# EAGLE design Physical_Computing_Bridge_V6 (EAGLE 8.5.1)
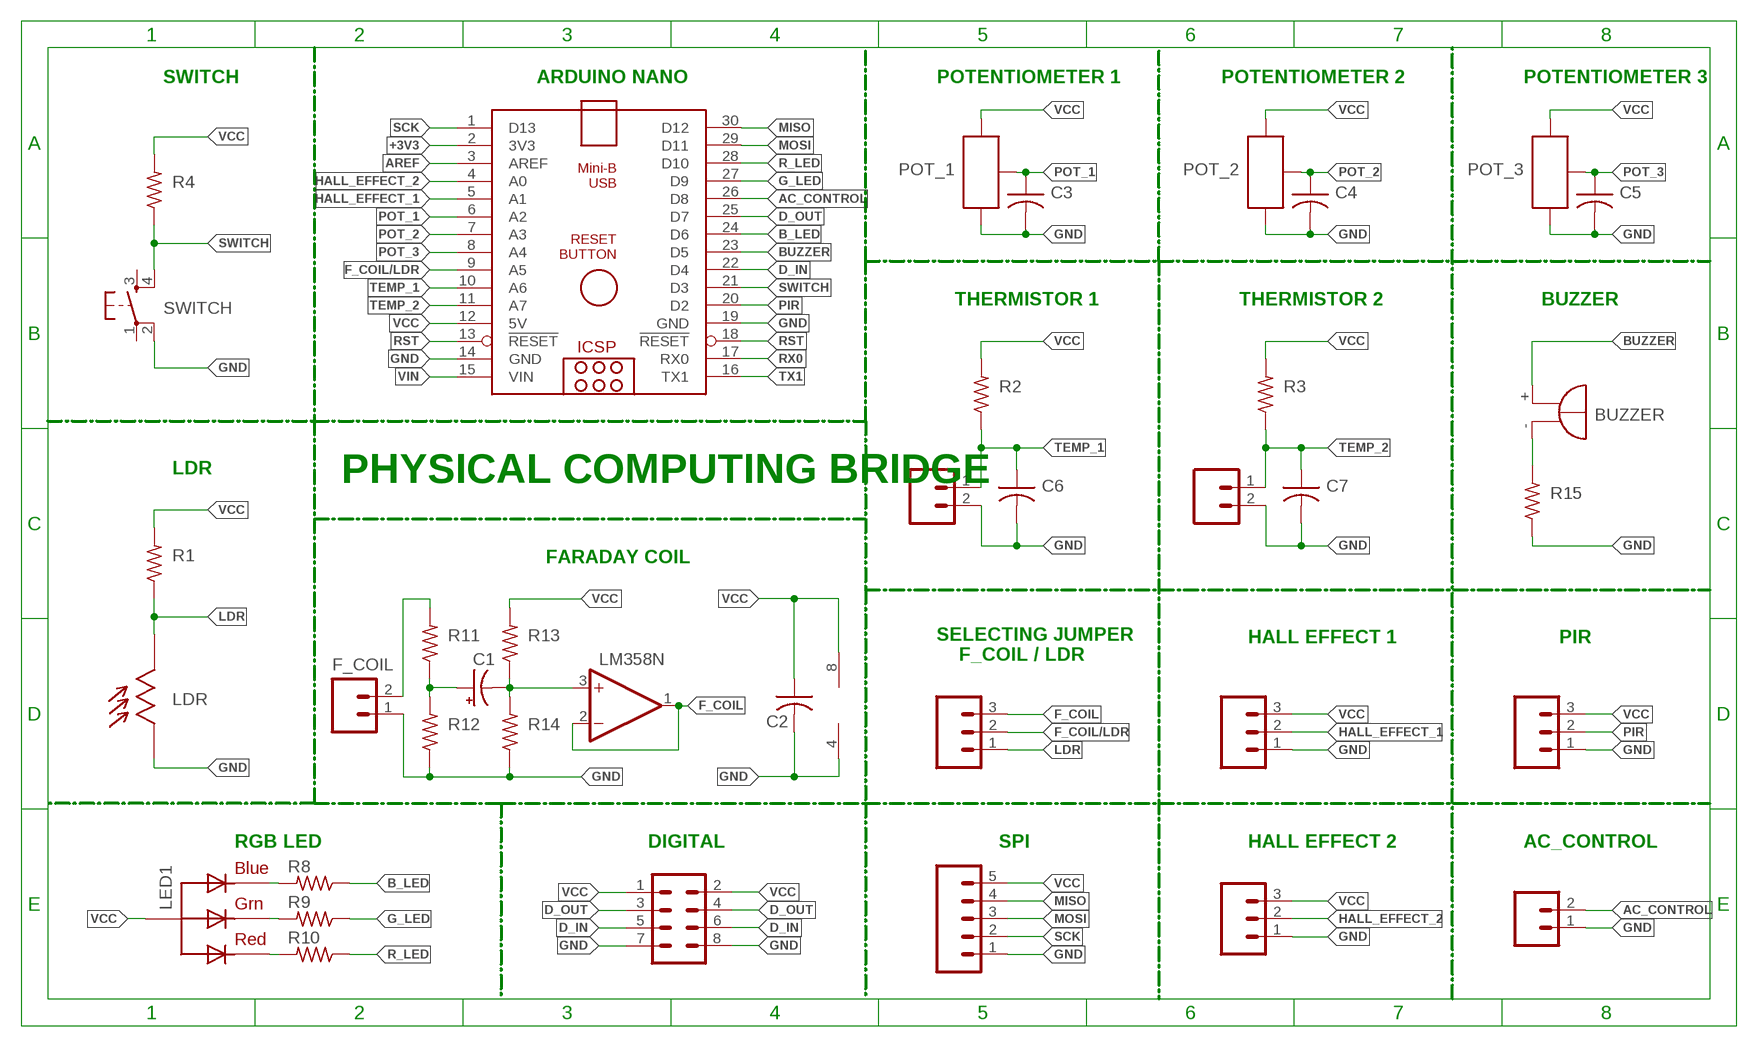
[diagram p0: schematic, sheet 1]

## Parts
AC_CONTROL  CONN_02POLAR  [MOLEX-1X2]
ARDUINO_NANO1  ARDUINO_NANO  [ARDUINO_NANO]
BUZZER  BUZZER  [F/TMB]
C1  CPOL-USE2.5-7  [E2,5-7]
C2  C-US025-025X050  [C025-025X050]
C3  C-US025-025X050  [C025-025X050]
C4  C-US025-025X050  [C025-025X050]
C5  C-US025-025X050  [C025-025X050]
C6  C-US025-025X050  [C025-025X050]
C7  C-US025-025X050  [C025-025X050]
DIGITAL  CONN_04X2  [2X4]
F_COIL  CONN_02POLAR  [MOLEX-1X2]
HALL_EFFECT_1  CONN_03POLAR  [MOLEX-1X3]
HALL_EFFECT_2  CONN_03POLAR  [MOLEX-1X3]
IC1  LM358N  [DIL08]
LDR  CDSLDR3MM  [LDR3MM]
LED1  RGBLED_CA-5MM  [LED5MMRGB]
PIR  CONN_03POLAR  [MOLEX-1X3]
POT_1  POTNORMAL  [RJ9W]
POT_2  POTNORMAL  [RJ9W]
POT_3  POTNORMAL  [RJ9W]
R1  R-US_0204/7  [0204/7]
R2  R-US_0204/7  [0204/7]
R3  R-US_0204/7  [0204/7]
R4  R-US_0204/7  [0204/7]
R8  R-US_0204/7  [0204/7]
R9  R-US_0204/7  [0204/7]
R10  R-US_0204/7  [0204/7]
R11  R-US_0204/7  [0204/7]
R12  R-US_0204/7  [0204/7]
R13  R-US_0204/7  [0204/7]
R14  R-US_0204/7  [0204/7]
R15  R-US_0204/7  [0204/7]
SELECTINGJUMPER  CONN_03LONGPADS  [1X03_LONGPADS]
SPI  CONN_05PTH_LONGPADS  [1X05_LONGPADS]
SWITCH  OMRON_SWITCH_40-XX  [B3F-40XX]
THERMISTOR1  CONN_02POLAR  [MOLEX-1X2]
THERMISTOR2  CONN_02POLAR  [MOLEX-1X2]

## Nets
+3V3: ARDUINO_NANO1.2(3V3)
AC_CONTROL: AC_CONTROL.2 ARDUINO_NANO1.26(D8)
AREF: ARDUINO_NANO1.3(AREF)
B_LED: ARDUINO_NANO1.24(D6) R8.1
BUZZER: ARDUINO_NANO1.23(D5) BUZZER.+
D_IN: ARDUINO_NANO1.22(D4) DIGITAL.5 DIGITAL.6
D_OUT: ARDUINO_NANO1.25(D7) DIGITAL.3 DIGITAL.4
F_COIL: IC1.1(A:OUT) IC1.2(A:-IN) SELECTINGJUMPER.3
F_COIL/LDR: ARDUINO_NANO1.9(A5) SELECTINGJUMPER.2
G_LED: ARDUINO_NANO1.27(D9) R9.1
GND: AC_CONTROL.1 ARDUINO_NANO1.14(GND) ARDUINO_NANO1.19(GND) C2.2 C3.2 C4.2 C5.2 C6.2 C7.2 DIGITAL.7 DIGITAL.8 F_COIL.1 HALL_EFFECT_1.1 HALL_EFFECT_2.1 IC1.4(P:V-) LDR.P$1 PIR.1 POT_1.E POT_2.E POT_3.E R12.1 R14.1 R15.1 SPI.1 SWITCH.2(P1) THERMISTOR1.2 THERMISTOR2.2
HALL_EFFECT_1: ARDUINO_NANO1.5(A1) HALL_EFFECT_1.2
HALL_EFFECT_2: ARDUINO_NANO1.4(A0) HALL_EFFECT_2.2
LDR: LDR.P$2 R1.1 SELECTINGJUMPER.1
MISO: ARDUINO_NANO1.30(D12) SPI.4
MOSI: ARDUINO_NANO1.29(D11) SPI.3
N$1: LED1.1(RED) R10.2
N$2: LED1.3(GREEN) R9.2
N$3: LED1.4(BLUE) R8.2
N$4: F_COIL.2 R11.2
N$6: C1.+ R11.1 R12.2
N$7: C1.- IC1.3(A:+IN) R13.1 R14.2
N$8: BUZZER.- R15.2
PIR: ARDUINO_NANO1.20(D2) PIR.2
POT_1: ARDUINO_NANO1.6(A2) C3.1 POT_1.S
POT_2: ARDUINO_NANO1.7(A3) C4.1 POT_2.S
POT_3: ARDUINO_NANO1.8(A4) C5.1 POT_3.S
R_LED: ARDUINO_NANO1.28(D10) R10.1
RST: ARDUINO_NANO1.13(!RESET) ARDUINO_NANO1.18(!RESET)
RX0: ARDUINO_NANO1.17(RX0)
SCK: ARDUINO_NANO1.1(D13) SPI.2
SWITCH: ARDUINO_NANO1.21(D3) R4.1 SWITCH.4(S1)
TEMP_1: ARDUINO_NANO1.10(A6) C6.1 R2.1 THERMISTOR1.1
TEMP_2: ARDUINO_NANO1.11(A7) C7.1 R3.1 THERMISTOR2.1
TX1: ARDUINO_NANO1.16(TX1)
VCC: ARDUINO_NANO1.12(5V) C2.1 DIGITAL.1 DIGITAL.2 HALL_EFFECT_1.3 HALL_EFFECT_2.3 IC1.8(P:V+) LED1.2(VCC) PIR.3 POT_1.A POT_2.A POT_3.A R1.2 R2.2 R3.2 R4.2 R13.2 SPI.5
VIN: ARDUINO_NANO1.15(VIN)
Unconnected: IC1.5(B:+IN) IC1.6(B:-IN) IC1.7(B:OUT) SWITCH.1(P) SWITCH.3(S)

## Notes on the sheet
- SWITCH | ARDUINO NANO | POTENTIOMETER 1 | POTENTIOMETER 2 | POTENTIOMETER 3
- THERMISTOR 1 | THERMISTOR 2 | BUZZER
- LDR
- PHYSICAL COMPUTING BRIDGE
- FARADAY COIL
- HALL EFFECT 1 | PIR
- SELECTING JUMPER
      F_COIL / LDR
- RGB LED | DIGITAL | SPI | HALL EFFECT 2 | AC_CONTROL

## Library data of the parts
AC_CONTROL F_COIL THERMISTOR1 THERMISTOR2 = SparkFun-Connectors:CONN_02: Multi connection point. Often used as Generic Header-pin footprint for 0.1 inch spaced/style header connections On any of the 0.1 inch spaced packages, you can populate with these: Break Away Headers - Straight <https://www.sparkfun.com/products/116> (PRT-00116) Break Away Male Headers - Right Angle <https://www.sparkfun.com/products/553> (PRT-00553) Female Headers <https://www.sparkfun.com/products/115> (PRT-00115) Break Away Headers - Machine Pin <https://www.sparkfun.com/products/117> (PRT-00117) Break Away Female Headers - Swiss Machine Pin <https://www.sparkfun.com/products/743> (PRT-00743) For SCREWTERMINALS and SPRING TERMINALS visit here: Screw Terimnals on SparkFun.com <https://www.sparkfun.com/search/results?term=Screw+Terminals> (5mm/3.5mm/2.54mm spacing) This device is also useful as a general connection point to wire up your design to another part of your project. Our various solder wires solder well into these plated through hole pads. Hook-Up Wire - Assortment (Stranded, 22 AWG) <https://www.sparkfun.com/products/11375> (PRT-11375) Hook-Up Wire - Assortment (Solid Core, 22 AWG) <https://www.sparkfun.com/products/11367> (PRT-11367) View the entire wire category on our website here <https://www.sparkfun.com/categories/141> Special notes: Molex polarized connector foot print use with: PRT-08233 with associated crimp pins and housings. 2.54_SCREWTERM for use with PRT-10571. 3.5mm Screw Terminal footprints for PRT-08084 5mm Screw Terminal footprints for use with PRT-08432; SF_ID: PRT-09918
ARDUINO_NANO1 = ArduinoNanoV30:ARDUINO_NANO: Arduino Nano V3.0 Overview: The Arduino Nano is a small, complete, and breadboard-friendly board based on the ATmega328 (Arduino Nano 3.x) or ATmega168 (Arduino Nano 2.x). It has more or less the same functionality of the Arduino Duemilanove, but in a different package. It lacks only a DC power jack, and works with a Mini-B USB cable instead of a standard one. The Nano was designed and is being produced by Gravitech. Specifications: Microcontroller Atmel ATmega168 or ATmega328 Operating Voltage (logic level) 5 V Input Voltage (recommended) 7-12 V Input Voltage (limits) 6-20 V Digital I/O Pins 14 (of which 6 provide PWM output) Analog Input Pins 8 DC Current per I/O Pin 40 mA Flash Memory 16 KB (ATmega168) or 32 KB (ATmega328) of which 2 KB used by bootloader SRAM 1 KB (ATmega168) or 2 KB (ATmega328) EEPROM 512 bytes (ATmega168) or 1 KB (ATmega328) Clock Speed 16 MHz Dimensions 0.73" x 1.70" Length 45 mm Width 18 mm Weigth 5 g Power: The Arduino Nano can be powered via the Mini-B USB connection, 6-20V unregulated external power supply (pin 30), or 5V regulated external power supply (pin 27). The power source is automatically selected to the highest voltage source. Memory: The ATmega168 has 16 KB of flash memory for storing code (of which 2 KB is used for the bootloader); the ATmega328 has 32 KB, (also with 2 KB used for the bootloader). The ATmega168 has 1 KB of SRAM and 512 bytes of EEPROM (which can be read and written with the EEPROM library); the ATmega328 has 2 KB of SRAM and 1 KB of EEPROM. Input and Output: Each of the 14 digital pins on the Nano can be used as an input or output, using pinMode(), digitalWrite(), and digitalRead() functions. They operate at 5 volts. Each pin can provide or receive a maximum of 40 mA and has an internal pull-up resistor (disconnected by default) of 20-50 kOhms. In addition, some pins have specialized functions. Visit Arduino - ArduinoBoardNano <https://www.arduino.cc/en/Main/ArduinoBoardNano>
BUZZER = CEDT_JANUARY_2015_v5:BUZZER: BUZZER Source: Buerklin; OC_FARNELL: unknown; OC_NEWARK: unknown
C1 = rcl:CPOL-US: POLARIZED CAPACITOR, American symbol; SPICEPREFIX: C
C2-C7 = rcl:C-US: CAPACITOR, American symbol; SPICEPREFIX: C
DIGITAL = SparkFun-Connectors:CONN_04X2: Multi connection point. Often used as Generic Header-pin footprint for 0.1 inch spaced/style header connections On any of the 0.1 inch spaced packages, you can populate with these: Break Away Headers - Straight <https://www.sparkfun.com/products/116> (PRT-00116) Break Away Male Headers - Right Angle <https://www.sparkfun.com/products/553> (PRT-00553) Female Headers <https://www.sparkfun.com/products/115> (PRT-00115) Break Away Headers - Machine Pin <https://www.sparkfun.com/products/117> (PRT-00117) Break Away Female Headers - Swiss Machine Pin <https://www.sparkfun.com/products/743> (PRT-00743)
HALL_EFFECT_1 HALL_EFFECT_2 PIR = SparkFun-Connectors:CONN_03: Multi connection point. Often used as Generic Header-pin footprint for 0.1 inch spaced/style header connections On any of the 0.1 inch spaced packages, you can populate with these: Break Away Headers - Straight <https://www.sparkfun.com/products/116> (PRT-00116) Break Away Male Headers - Right Angle <https://www.sparkfun.com/products/553> (PRT-00553) Female Headers <https://www.sparkfun.com/products/115> (PRT-00115) Break Away Headers - Machine Pin <https://www.sparkfun.com/products/117> (PRT-00117) Break Away Female Headers - Swiss Machine Pin <https://www.sparkfun.com/products/743> (PRT-00743) Stackable Header - 3 Pin (Female, 0.1") <https://www.sparkfun.com/products/13875> (PRT-13875) For SCREWTERMINALS and SPRING TERMINALS visit here: Screw Terimnals on SparkFun.com <https://www.sparkfun.com/search/results?term=Screw+Terminals> (5mm/3.5mm/2.54mm spacing) This device is also useful as a general connection point to wire up your design to another part of your project. Our various solder wires solder well into these plated through hole pads. Hook-Up Wire - Assortment (Stranded, 22 AWG) <https://www.sparkfun.com/products/11375> (PRT-11375) Hook-Up Wire - Assortment (Solid Core, 22 AWG) <https://www.sparkfun.com/products/11367> (PRT-11367) View the entire wire category on our website here <https://www.sparkfun.com/categories/141> Special notes: Molex polarized connector foot print use with SKU : PRT-08232 with associated crimp pins and housings.; PROD_ID: CONN-08625; SF_ID: PRT-08096
IC1 = CEDT_JANUARY_2015_v5:LM358: OP AMP also LM158; LM258; LM2904 Source: http://cache.national.com/ds/LM/LM158.pdf
LDR = CEDT_JANUARY_2015_v5:CDSLDR3MM
LED1 = adafruit:RGBLED_CA: RGB LED, common-anode 5MM Staggered pins 5mm Piranha package http://www.ladyada.net/library/pcb/eaglelibrary.html
POT_1-POT_3 = CEDT_JANUARY_2015_v5:POT
R1-R4 R8-R15 = rcl:R-US_: RESISTOR, American symbol; SPICEPREFIX: R
SELECTINGJUMPER = SparkFun-Connectors:CONN_03: Multi connection point. Often used as Generic Header-pin footprint for 0.1 inch spaced/style header connections On any of the 0.1 inch spaced packages, you can populate with these: Break Away Headers - Straight <https://www.sparkfun.com/products/116> (PRT-00116) Break Away Male Headers - Right Angle <https://www.sparkfun.com/products/553> (PRT-00553) Female Headers <https://www.sparkfun.com/products/115> (PRT-00115) Break Away Headers - Machine Pin <https://www.sparkfun.com/products/117> (PRT-00117) Break Away Female Headers - Swiss Machine Pin <https://www.sparkfun.com/products/743> (PRT-00743) Stackable Header - 3 Pin (Female, 0.1") <https://www.sparkfun.com/products/13875> (PRT-13875) For SCREWTERMINALS and SPRING TERMINALS visit here: Screw Terimnals on SparkFun.com <https://www.sparkfun.com/search/results?term=Screw+Terminals> (5mm/3.5mm/2.54mm spacing) This device is also useful as a general connection point to wire up your design to another part of your project. Our various solder wires solder well into these plated through hole pads. Hook-Up Wire - Assortment (Stranded, 22 AWG) <https://www.sparkfun.com/products/11375> (PRT-11375) Hook-Up Wire - Assortment (Solid Core, 22 AWG) <https://www.sparkfun.com/products/11367> (PRT-11367) View the entire wire category on our website here <https://www.sparkfun.com/categories/141> Special notes: Molex polarized connector foot print use with SKU : PRT-08232 with associated crimp pins and housings.
SPI = SparkFun-Connectors:CONN_05: Multi connection point. Often used as Generic Header-pin footprint for 0.1 inch spaced/style header connections On any of the 0.1 inch spaced packages, you can populate with these: Break Away Headers - Straight <https://www.sparkfun.com/products/116> (PRT-00116) Break Away Male Headers - Right Angle <https://www.sparkfun.com/products/553> (PRT-00553) Female Headers <https://www.sparkfun.com/products/115> (PRT-00115) Break Away Headers - Machine Pin <https://www.sparkfun.com/products/117> (PRT-00117) Break Away Female Headers - Swiss Machine Pin <https://www.sparkfun.com/products/743> (PRT-00743) For SCREWTERMINALS and SPRING TERMINALS visit here: Screw Terimnals on SparkFun.com <https://www.sparkfun.com/search/results?term=Screw+Terminals> (5mm/3.5mm/2.54mm spacing) This device is also useful as a general connection point to wire up your design to another part of your project. Our various solder wires solder well into these plated through hole pads. Hook-Up Wire - Assortment (Stranded, 22 AWG) <https://www.sparkfun.com/products/11375> (PRT-11375) Hook-Up Wire - Assortment (Solid Core, 22 AWG) <https://www.sparkfun.com/products/11367> (PRT-11367) View the entire wire category on our website here <https://www.sparkfun.com/categories/141> Special notes: Molex polarized connector foot print use with SKU : PRT-08231 with associated crimp pins and housings. 1MM SMD Version SKU: PRT-10208
SWITCH = CEDT_JANUARY_2015_v5:OMRON_SWITCH

## Board
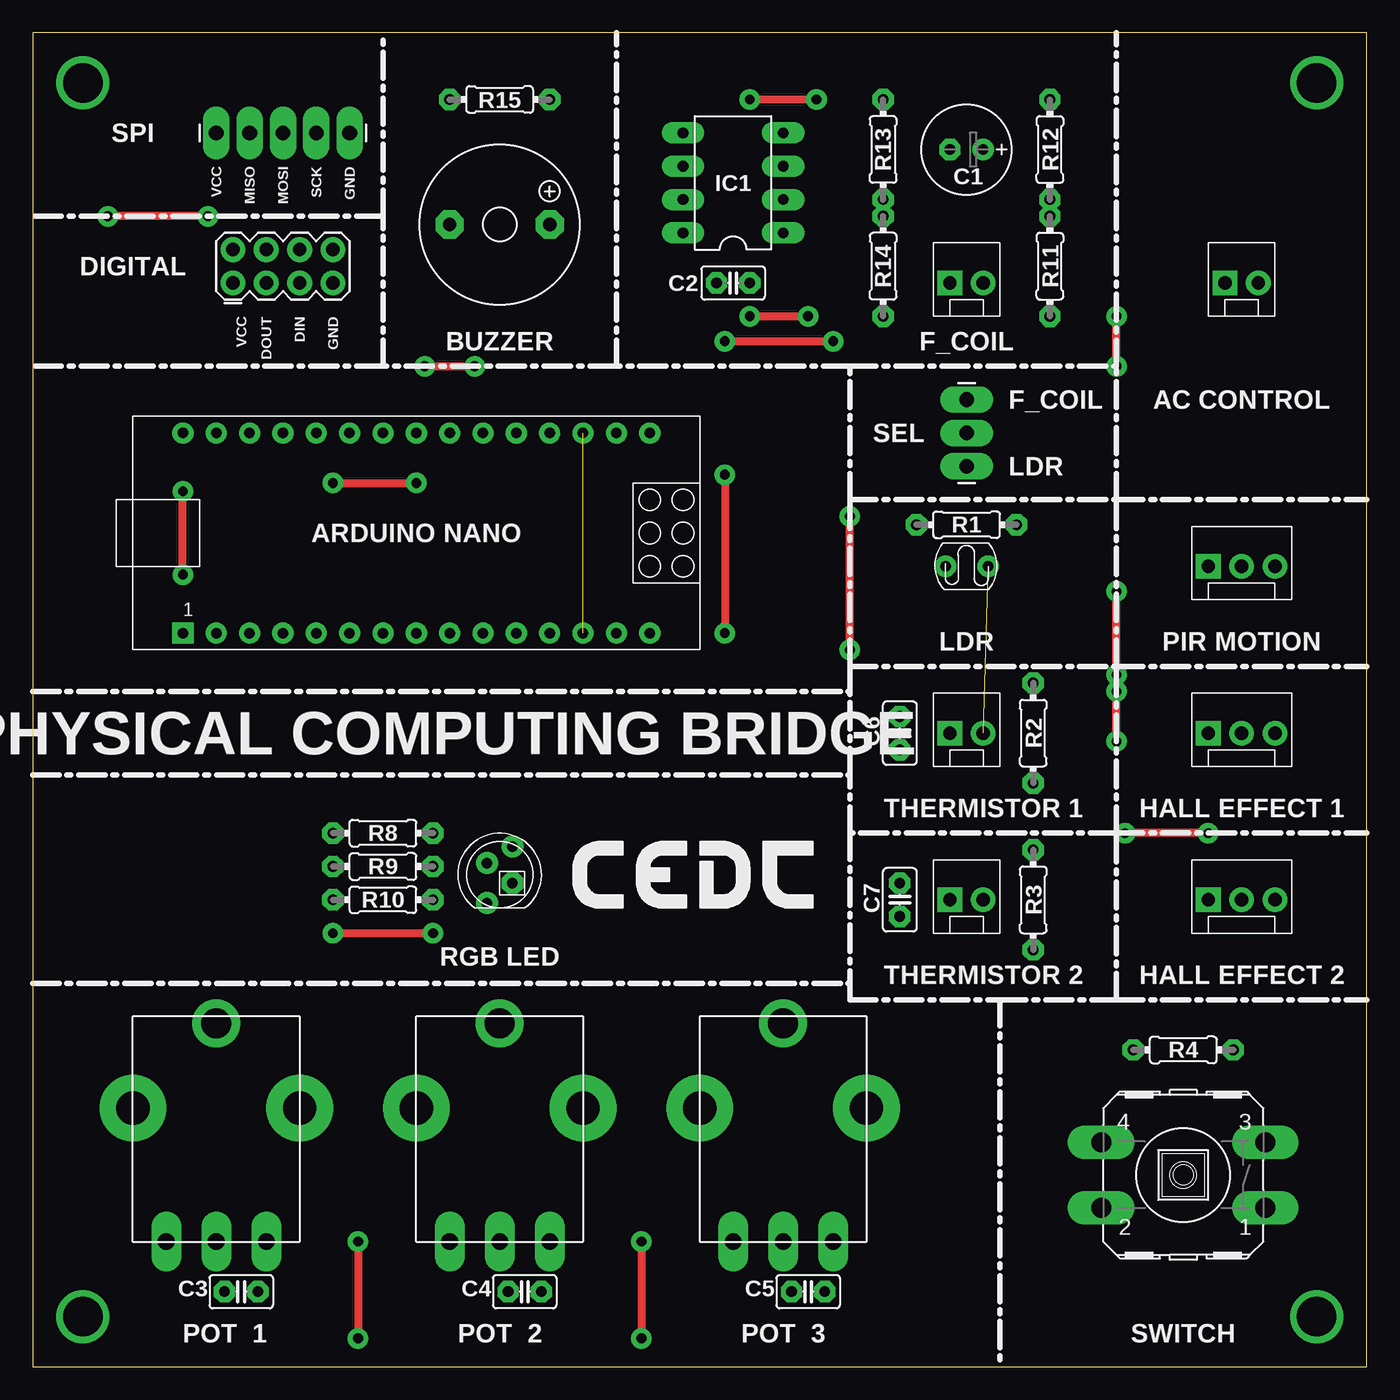
[diagram p1: board, top side]
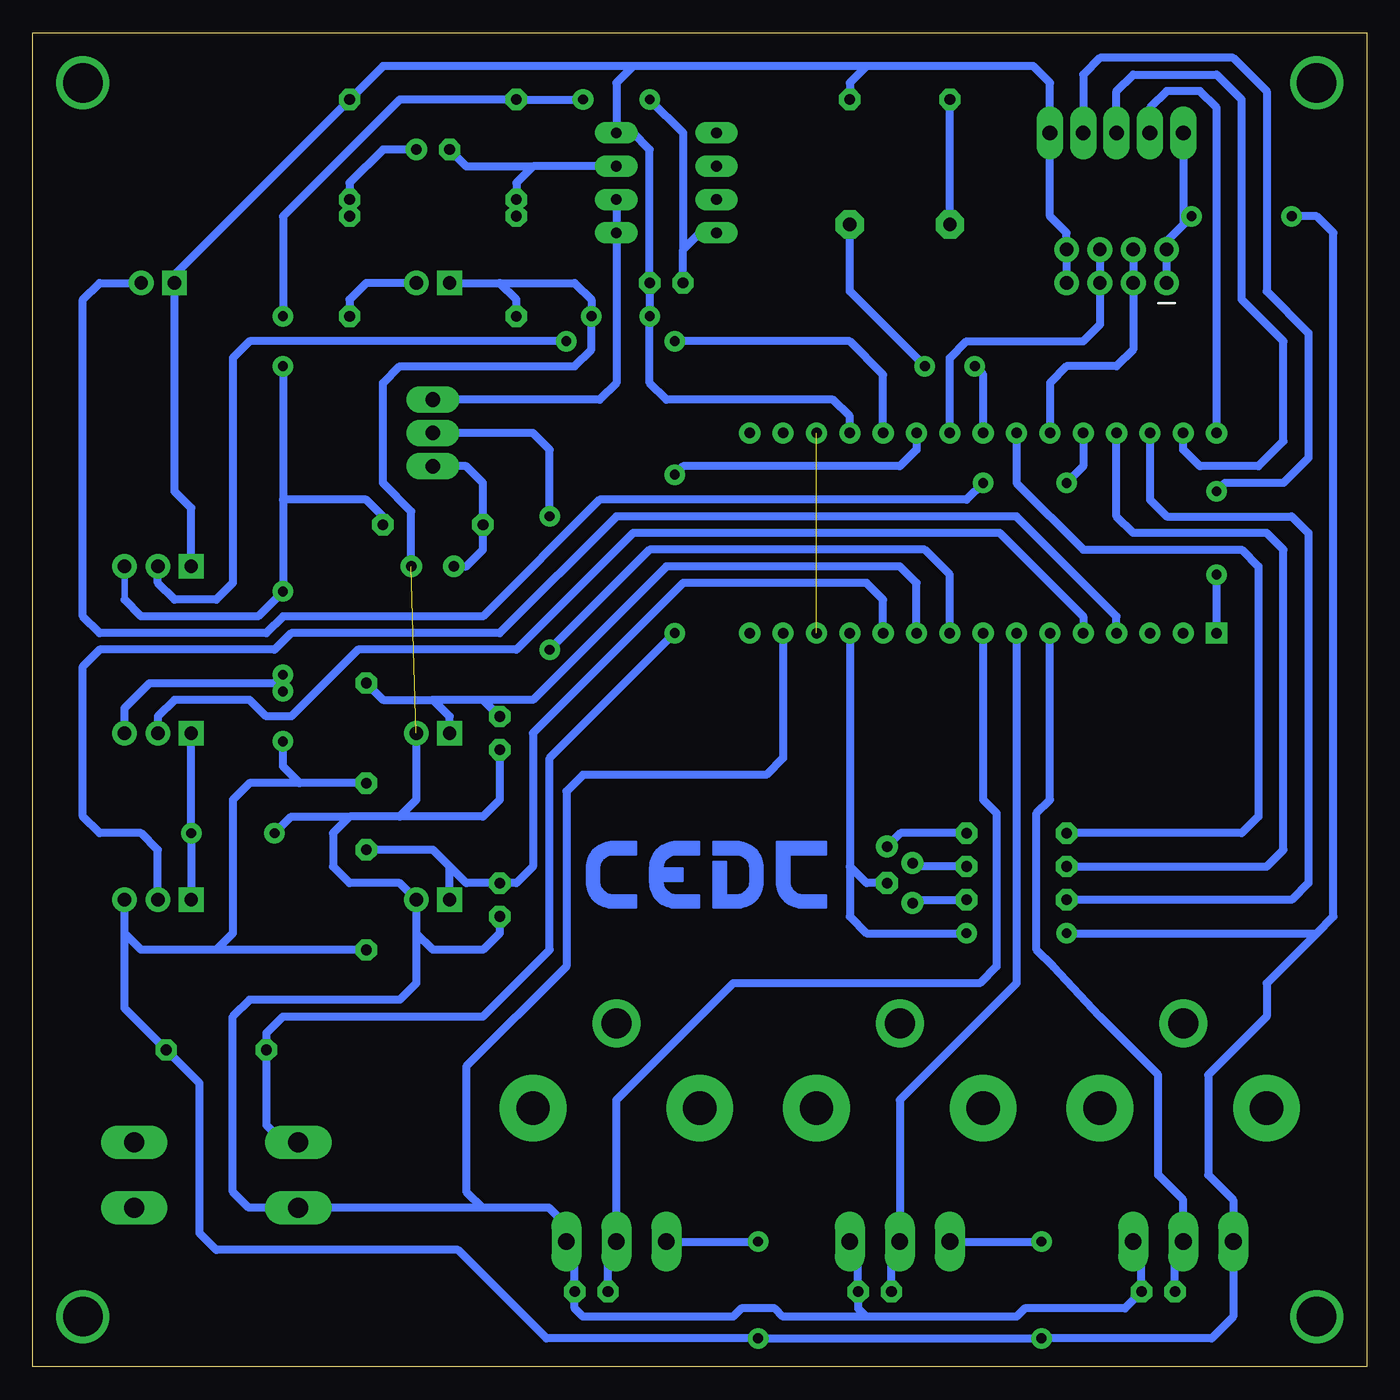
[diagram p2: board, bottom side, seen from below]

Size 101.6 x 101.6 mm. Coordinates in mm from the lower left corner, seen from the top.
Outline: 0,0 101.6,0 101.6,101.6 0,101.6 0,0
Copper layers (1*16): Top 0.035mm / dielectric 1.5mm / Bottom 0.035mm
Design rules "default *": minimum track width 6mil, minimum drill 0.35mm, track to track 12mil, track to pad 12mil, pad to pad 12mil, via to via 12mil, smd to smd 12mil, copper to edge 40mil, drill to drill 6mil, minimum pad ring 16mil, minimum via ring 16mil, stop-mask expansion 4mil, vias tented up to drill 0mil, thermal gap 10mil

### Footprints (pad centres in the part's own frame; a part is rotated, then mirrored left to right if it is on the bottom)
MOLEX-1X2 = drill 1.016 pad 1.88 square: 1 0,0 | drill 1.016 pad 1.88: 2 2.54,0
ARDUINO_NANO = drill 0.8 square: 1 -20.32,-7.62 | drill 0.8: 2 -17.78,-7.62; 3 -15.24,-7.62; 4 -12.7,-7.62; 5 -10.16,-7.62; 6 -7.62,-7.62; 7 -5.08,-7.62; 8 -2.54,-7.62; 9 0,-7.62; 10 2.54,-7.62; 11 5.08,-7.62; 12 7.62,-7.62; 13 10.16,-7.62; 14 12.7,-7.62; 15 15.24,-7.62; 16 15.24,7.62; 17 12.7,7.62; 18 10.16,7.62; 19 7.62,7.62; 20 5.08,7.62; 21 2.54,7.62; 22 0,7.62; 23 -2.54,7.62; 24 -5.08,7.62; 25 -7.62,7.62; 26 -10.16,7.62; 27 -12.7,7.62; 28 -15.24,7.62; 29 -17.78,7.62; 30 -20.32,7.62
F/TMB = drill 1.016 pad 2.159 octagon: + 3.81,0; - -3.81,0
E2,5-7 = drill 0.813 pad 1.6: + -1.27,0 | drill 0.813 pad 1.6 octagon: - 1.27,0
C025-025X050 = drill 0.813 octagon: 1 -1.27,0; 2 1.27,0
2X4 = drill 1.016 pad 1.88: 1 -3.81,-1.27; 2 -3.81,1.27; 3 -1.27,-1.27; 4 -1.27,1.27; 5 1.27,-1.27; 6 1.27,1.27; 7 3.81,-1.27; 8 3.81,1.27
MOLEX-1X3 = drill 1.016 pad 1.88 square: 1 0,0 | drill 1.016 pad 1.88: 2 2.54,0; 3 5.08,0
DIL08 = drill 0.813 long: 1 -3.81,-3.81; 2 -1.27,-3.81; 3 1.27,-3.81; 4 3.81,-3.81; 5 3.81,3.81; 6 1.27,3.81; 7 -1.27,3.81; 8 -3.81,3.81
LDR3MM = drill 0.8: P$1 0,0; P$2 3.24,0
LED5MMRGB = drill 0.8 pad 1.676: 1 -2.159,0.968; 3 0.889,0.968; 4 2.159,-0.968 | drill 0.8 pad 1.676 octagon: 2 -0.635,-0.968
RJ9W = drill 1.27 long: A 3.81,8.255; E -3.81,8.255; S 0,8.255 | drill 2.286 pad 3.658: P$1 0,-8.382 | drill 2.54 pad 5.08: P$3 6.35,-1.905; P$4 -6.35,-1.905
0204/7 = drill 0.813 octagon: 1 -3.81,0; 2 3.81,0
1X03_LONGPADS = drill 1.118 pad 1.88 long: 1 0,0; 2 2.54,0; 3 5.08,0
1X05_LONGPADS = drill 1.118 pad 1.88 long: 1 0,0; 2 2.54,0; 3 5.08,0; 4 7.62,0; 5 10.16,0
B3F-40XX = drill 1.524 long: 1 -6.248,2.489; 2 6.248,2.489; 3 -6.248,-2.489; 4 6.248,-2.489

### Placement (x,y rotation side)
AC_CONTROL  90.81,82.55 0 top
ARDUINO_NANO1  31.75,63.5 0 top
BUZZER  35.56,87 0 top
C1  71.12,92.71 180 top
C2  53.34,82.55 0 top
C3  15.88,5.71 0 top
C4  37.47,5.71 0 top
C5  59.05,5.71 0 top
C6  66.04,48.26 270 top
C7  66.04,35.56 270 top
DIGITAL  19.05,83.82 0 top
F_COIL  69.85,82.55 0 top
HALL_EFFECT_1  89.53,48.26 0 top
HALL_EFFECT_2  89.53,35.56 0 top
IC1  53.34,90.17 90 top
LDR  72.77,60.96 180 top
LED1  35.56,37.47 90 top
PIR  89.53,60.96 0 top
POT_1  13.97,17.78 180 top
POT_2  35.56,17.78 180 top
POT_3  57.15,17.78 180 top
R1  71.12,64.14 0 top
R2  76.2,48.26 270 top
R3  76.2,35.56 270 top
R4  87.63,24.13 0 top
R8  26.67,40.64 0 top
R9  26.67,38.1 0 top
R10  26.67,35.56 0 top
R11  77.47,83.82 270 top
R12  77.47,92.71 270 top
R13  64.77,92.71 90 top
R14  64.77,83.82 90 top
R15  35.56,96.52 180 top
SELECTINGJUMPER  71.12,68.58 90 top
SPI  24.13,93.98 180 top
SWITCH  87.63,14.61 180 top
THERMISTOR1  69.85,48.26 0 top
THERMISTOR2  69.85,35.56 0 top
U$2  [LOGO-CEDT-BOT-18MM]  41.15,34.92 0 top
U$3  [LOGO-CEDT-SILK-18MM]  41.15,34.92 0 top

### Tracks (layer width: path | path; a pad name or v marks a point on that pad's centre or on a via)
AC_CONTROL  (via drill 0.75 pad 1.2)
  Top 0.61: v22.86,67.31 v29.21,67.31
  Bottom 0.61: ARDUINO_NANO1.26 21.59,68.58 v22.86,67.31 | AC_CONTROL.2 96.52,82.55 97.79,81.28 97.79,57.15 96.52,55.88 83.82,55.88 82.55,57.15 67.31,57.15 58.42,66.04 30.48,66.04 v29.21,67.31
B_LED
  Bottom 0.61: ARDUINO_NANO1.24 26.67,67.31 21.59,62.23 9.53,62.23 8.26,60.96 8.26,41.91 9.53,40.64 R8.1
BUZZER  (via drill 0.75 pad 1.2)
  Top 0.61: v29.84,76.2 v33.66,76.2
  Bottom 0.61: ARDUINO_NANO1.23 29.21,75.56 v29.84,76.2 | v33.66,76.2 39.37,81.92 BUZZER.+
D_IN
  Bottom 0.61: DIGITAL.6 DIGITAL.5 20.32,79.38 21.59,78.11 30.48,78.11 31.75,76.83 ARDUINO_NANO1.22
D_OUT
  Bottom 0.61: DIGITAL.4 DIGITAL.3 17.78,77.47 19.05,76.2 22.86,76.2 24.13,74.93 ARDUINO_NANO1.25
F_COIL
  Bottom 0.61: IC1.2 IC1.1 57.15,74.93 58.42,73.66 SELECTINGJUMPER.3
F_COIL/LDR  (via drill 0.75 pad 1.2)
  Top 0.61: v62.23,54.61 v62.23,64.77
  Bottom 0.61: ARDUINO_NANO1.9 31.75,60.33 33.66,62.23 54.61,62.23 v62.23,54.61 | SELECTINGJUMPER.2 63.5,71.12 62.23,69.85 v62.23,64.77
G_LED
  Bottom 0.61: R9.1 7.62,38.1 6.35,39.37 6.35,62.23 7.62,63.5 17.78,63.5 19.05,64.77 ARDUINO_NANO1.27
GND  (via drill 0.75 pad 1.2)  (1 unrouted)
  Top 0.61: v54.61,80.01 v59.05,80.01 | v89.53,40.64 v83.19,40.64
  Bottom 0.61: DIGITAL.7 DIGITAL.8 22.86,86.36 24.13,87.63 SPI.1 24.13,97.79 25.4,99.06 38.1,99.06 | 38.1,99.06 39.37,97.79 R15.1 | 38.1,99.06 55.88,99.06 | 55.88,99.06 57.15,97.79 IC1.4 55.88,93.98 54.61,92.71 C2.2 v54.61,80.01 54.61,74.93 53.34,73.66 40.64,73.66 39.37,72.39 ARDUINO_NANO1.19 | HALL_EFFECT_1.1 v89.53,40.64 HALL_EFFECT_2.1 | 73.66,41.91 77.47,41.91 | 67.36,12.12 62.28,12.12 60.96,10.79 POT_3.E 60.33,8.89 C5.2 60.33,4.45 59.69,3.81 48.26,3.81 47.62,4.45 45.09,4.45 44.45,3.81 38.1,3.81 | 67.36,12.12 SWITCH.2 85.14,12.12 86.36,13.34 86.36,26.67 85.09,27.94 73.66,27.94 72.39,29.21 72.39,33.02 | 67.36,12.12 68.58,13.34 68.58,22.86 60.96,30.48 60.96,43.81 59.69,45.09 45.72,45.09 44.45,46.35 ARDUINO_NANO1.14 | F_COIL.1 66.04,82.55 | 66.04,82.55 60.33,82.55 59.05,81.28 v59.05,80.01 59.05,77.47 60.33,76.2 73.66,76.2 74.93,74.93 74.93,67.31 72.77,65.15 LDR.P$1 | R14.1 64.77,81.28 66.04,82.55 | 55.88,99.06 74.93,99.06 R12.1 90.81,83.19 AC_CONTROL.1 90.81,66.67 89.53,65.41 PIR.1 | 77.47,41.91 78.74,40.64 78.74,38.1 77.47,36.83 73.66,36.83 THERMISTOR2.2 72.39,33.02 | THERMISTOR1.2 72.39,43.18 73.66,41.91 | v83.19,40.64 81.92,41.91 77.47,41.91 | C6.2 66.04,43.18 67.31,41.91 73.66,41.91 | C7.2 66.04,33.02 67.31,31.75 71.12,31.75 72.39,33.02 | POT_1.E 17.14,8.89 C3.2 18.41,4.45 26.04,4.45 26.67,3.81 38.1,3.81 | 38.1,3.81 38.73,4.45 C4.2 38.73,8.89 POT_2.E
HALL_EFFECT_1
  Bottom 0.61: HALL_EFFECT_1.2 92.08,49.53 90.81,50.8 85.09,50.8 83.82,49.53 81.92,49.53 76.83,54.61 64.77,54.61 55.88,63.5 27.94,63.5 21.59,57.15 ARDUINO_NANO1.5
HALL_EFFECT_2
  Bottom 0.61: HALL_EFFECT_2.2 92.08,39.37 93.34,40.64 96.52,40.64 97.79,41.91 97.79,53.34 96.52,54.61 83.19,54.61 81.92,55.88 66.04,55.88 57.15,64.77 26.67,64.77 19.05,57.15 ARDUINO_NANO1.4
LDR
  Bottom 0.61: LDR.P$2 68.58,60.96 67.31,62.23 R1.1 67.31,67.31 68.58,68.58 SELECTINGJUMPER.1
MISO
  Bottom 0.61: SPI.4 16.51,95.89 15.24,97.16 12.7,97.16 11.43,95.89 ARDUINO_NANO1.30
MOSI
  Bottom 0.61: SPI.3 19.05,97.16 17.78,98.42 11.43,98.42 9.53,96.52 9.53,81.28 6.35,78.11 6.35,70.48 8.26,68.58 12.7,68.58 13.97,69.85 ARDUINO_NANO1.29
N$1
  Bottom 0.61: LED1.1 34.34,35.56 R10.2
N$2
  Bottom 0.61: R9.2 34.34,38.1 LED1.3
N$3
  Bottom 0.61: R8.2 35.51,40.64 LED1.4
N$4
  Bottom 0.61: F_COIL.2 76.2,82.55 77.47,81.28 R11.2
N$6
  Bottom 0.61: C1.+ 74.93,92.71 77.47,90.17 R12.2 R11.1
N$7
  Bottom 0.61: R14.2 R13.1 64.77,90.17 63.5,91.44 | IC1.3 63.5,91.44 | C1.- 68.58,91.44 63.5,91.44
N$8
  Bottom 0.61: BUZZER.- R15.2
N$10  (via drill 3 pad 3.81)
  other vias: 3.81,97.79
N$11  (via drill 3 pad 3.81)
  other vias: 97.79,97.79
N$12  (via drill 3 pad 3.81)
  other vias: 97.79,3.81
N$13  (via drill 3 pad 3.81)
  other vias: 3.81,3.81
PIR  (via drill 0.75 pad 1.2)
  Top 0.61: v52.7,78.11 v60.96,78.11
  Bottom 0.61: ARDUINO_NANO1.20 36.83,75.56 39.37,78.11 v52.7,78.11 | v60.96,78.11 85.09,78.11 86.36,76.83 86.36,59.69 87.63,58.42 90.81,58.42 92.08,59.69 PIR.2
POT_1
  Bottom 0.61: ARDUINO_NANO1.6 24.13,43.18 25.15,42.16 25.15,31.75 23.88,30.48 20.32,26.67 15.88,22.23 15.88,14.61 13.97,12.7 POT_1.S 14.61,8.89 C3.1
POT_2
  Bottom 0.61: ARDUINO_NANO1.7 26.67,29.21 35.56,20.32 POT_2.S 36.2,8.89 C4.1
POT_3
  Bottom 0.61: ARDUINO_NANO1.8 29.21,43.18 28.19,42.16 28.19,30.48 29.46,29.21 48.26,29.21 57.15,20.32 POT_3.S 57.78,8.89 C5.1
R_LED
  Bottom 0.61: ARDUINO_NANO1.28 16.51,66.04 15.24,64.77 5.71,64.77 4.45,63.5 4.45,36.83 5.71,35.56 R10.1
RST  (1 unrouted)
SCK  (via drill 0.75 pad 1.2)
  Top 0.61: v11.43,60.33 v11.43,66.67
  Bottom 0.61: ARDUINO_NANO1.1 v11.43,60.33 | v11.43,66.67 10.79,67.31 6.35,67.31 4.45,69.22 4.45,78.74 7.62,81.92 7.62,97.16 10.16,99.69 20.32,99.69 21.59,98.42 SPI.2
SWITCH  (via drill 0.75 pad 1.2)
  Top 0.61: v52.7,67.94 v52.7,55.88
  Bottom 0.61: ARDUINO_NANO1.21 34.29,69.85 35.56,68.58 52.07,68.58 v52.7,67.94 | SWITCH.4 82.5,17.09 83.82,18.41 R4.1 83.82,25.4 82.55,26.67 67.31,26.67 62.23,31.75 62.23,46.35 v52.7,55.88
TEMP_1
  Bottom 0.61: ARDUINO_NANO1.10 34.29,59.69 35.56,60.96 53.34,60.96 63.5,50.8 67.31,50.8 | R2.1 74.93,50.8 71.12,50.8 | THERMISTOR1.1 69.85,49.53 71.12,50.8 | C6.1 67.31,50.8 | 67.31,50.8 71.12,50.8
TEMP_2
  Bottom 0.61: ARDUINO_NANO1.11 36.83,58.42 38.1,59.69 52.07,59.69 63.5,48.26 63.5,38.1 64.77,36.83 C7.1 68.58,36.83 69.85,38.1 | THERMISTOR2.1 69.85,38.1 | 69.85,38.1 71.12,39.37 R3.1
VCC  (via drill 0.75 pad 1.2)
  Top 0.61: v24.77,9.53 v24.77,2.16 | v46.35,9.53 v46.35,2.16 | v59.69,96.52 v54.61,96.52 | v82.55,76.2 v82.55,80.01 | v30.48,33.02 v22.86,33.02 | v13.34,87.63 v5.71,87.63 | v82.55,52.7 v82.55,59.05 | v82.55,47.62 v82.55,51.44
  Bottom 0.508: PIR.3 94.61,58.42
  Bottom 0.61: POT_2.A v24.77,9.53 | POT_3.A v46.35,9.53 | DIGITAL.1 DIGITAL.2 15.24,85.72 13.97,87 | C2.1 52.07,85.09 | 52.07,85.09 50.8,86.36 IC1.8 | v59.69,96.52 R13.2 73.66,96.52 82.55,87.63 v82.55,80.01 | v54.61,96.52 52.07,93.98 52.07,85.09 | 94.61,58.42 93.34,57.15 84.45,57.15 v82.55,59.05 82.55,66.04 | ARDUINO_NANO1.12 39.37,38.1 | 39.37,38.1 39.37,34.29 38.1,33.02 v30.48,33.02 | LED1.2 38.1,36.83 39.37,38.1 | v82.55,76.2 82.55,66.04 | HALL_EFFECT_1.3 94.61,50.16 92.71,52.07 83.19,52.07 v82.55,52.7 v82.55,51.44 | R2.2 81.28,44.45 | 81.28,44.45 82.55,45.72 v82.55,47.62 | 81.28,44.45 85.09,44.45 86.36,43.18 86.36,33.02 87.63,31.75 | 3.81,33.02 2.54,34.29 2.54,86.36 3.81,87.63 v5.71,87.63 | v22.86,33.02 3.81,33.02 | v13.34,87.63 13.97,87 | SPI.5 13.97,87 | 94.61,33.02 94.61,27.3 R4.2 88.9,21.59 88.9,10.16 87.63,8.89 69.22,8.89 62.48,2.16 v46.35,2.16 v24.77,2.16 11.81,2.16 10.16,3.81 POT_1.A 10.16,12.7 12.06,14.61 12.06,22.23 7.62,26.67 7.62,29.21 3.81,33.02 | 94.61,33.02 HALL_EFFECT_2.3 | R3.2 87.63,31.75 | 87.63,31.75 93.34,31.75 94.61,33.02 | R1.2 74.93,64.77 76.2,66.04 82.55,66.04

### Text on the board
tPlace: SPI | VCC | MISO | MOSI | SCK | GND | DIGITAL | VCC | DOUT | DIN | GND | BUZZER | F_COIL | F_COIL | AC CONTROL | SEL | LDR | ARDUINO NANO | LDR | PIR MOTION | PHYSICAL COMPUTING BRIDGE | THERMISTOR 1 | HALL EFFECT 1 | RGB LED | THERMISTOR 2 | HALL EFFECT 2 | POT 1 | POT 2 | POT 3 | SWITCH